# EAGLE schematic AK4493-v1.64_21 (EAGLE 9.6.2)
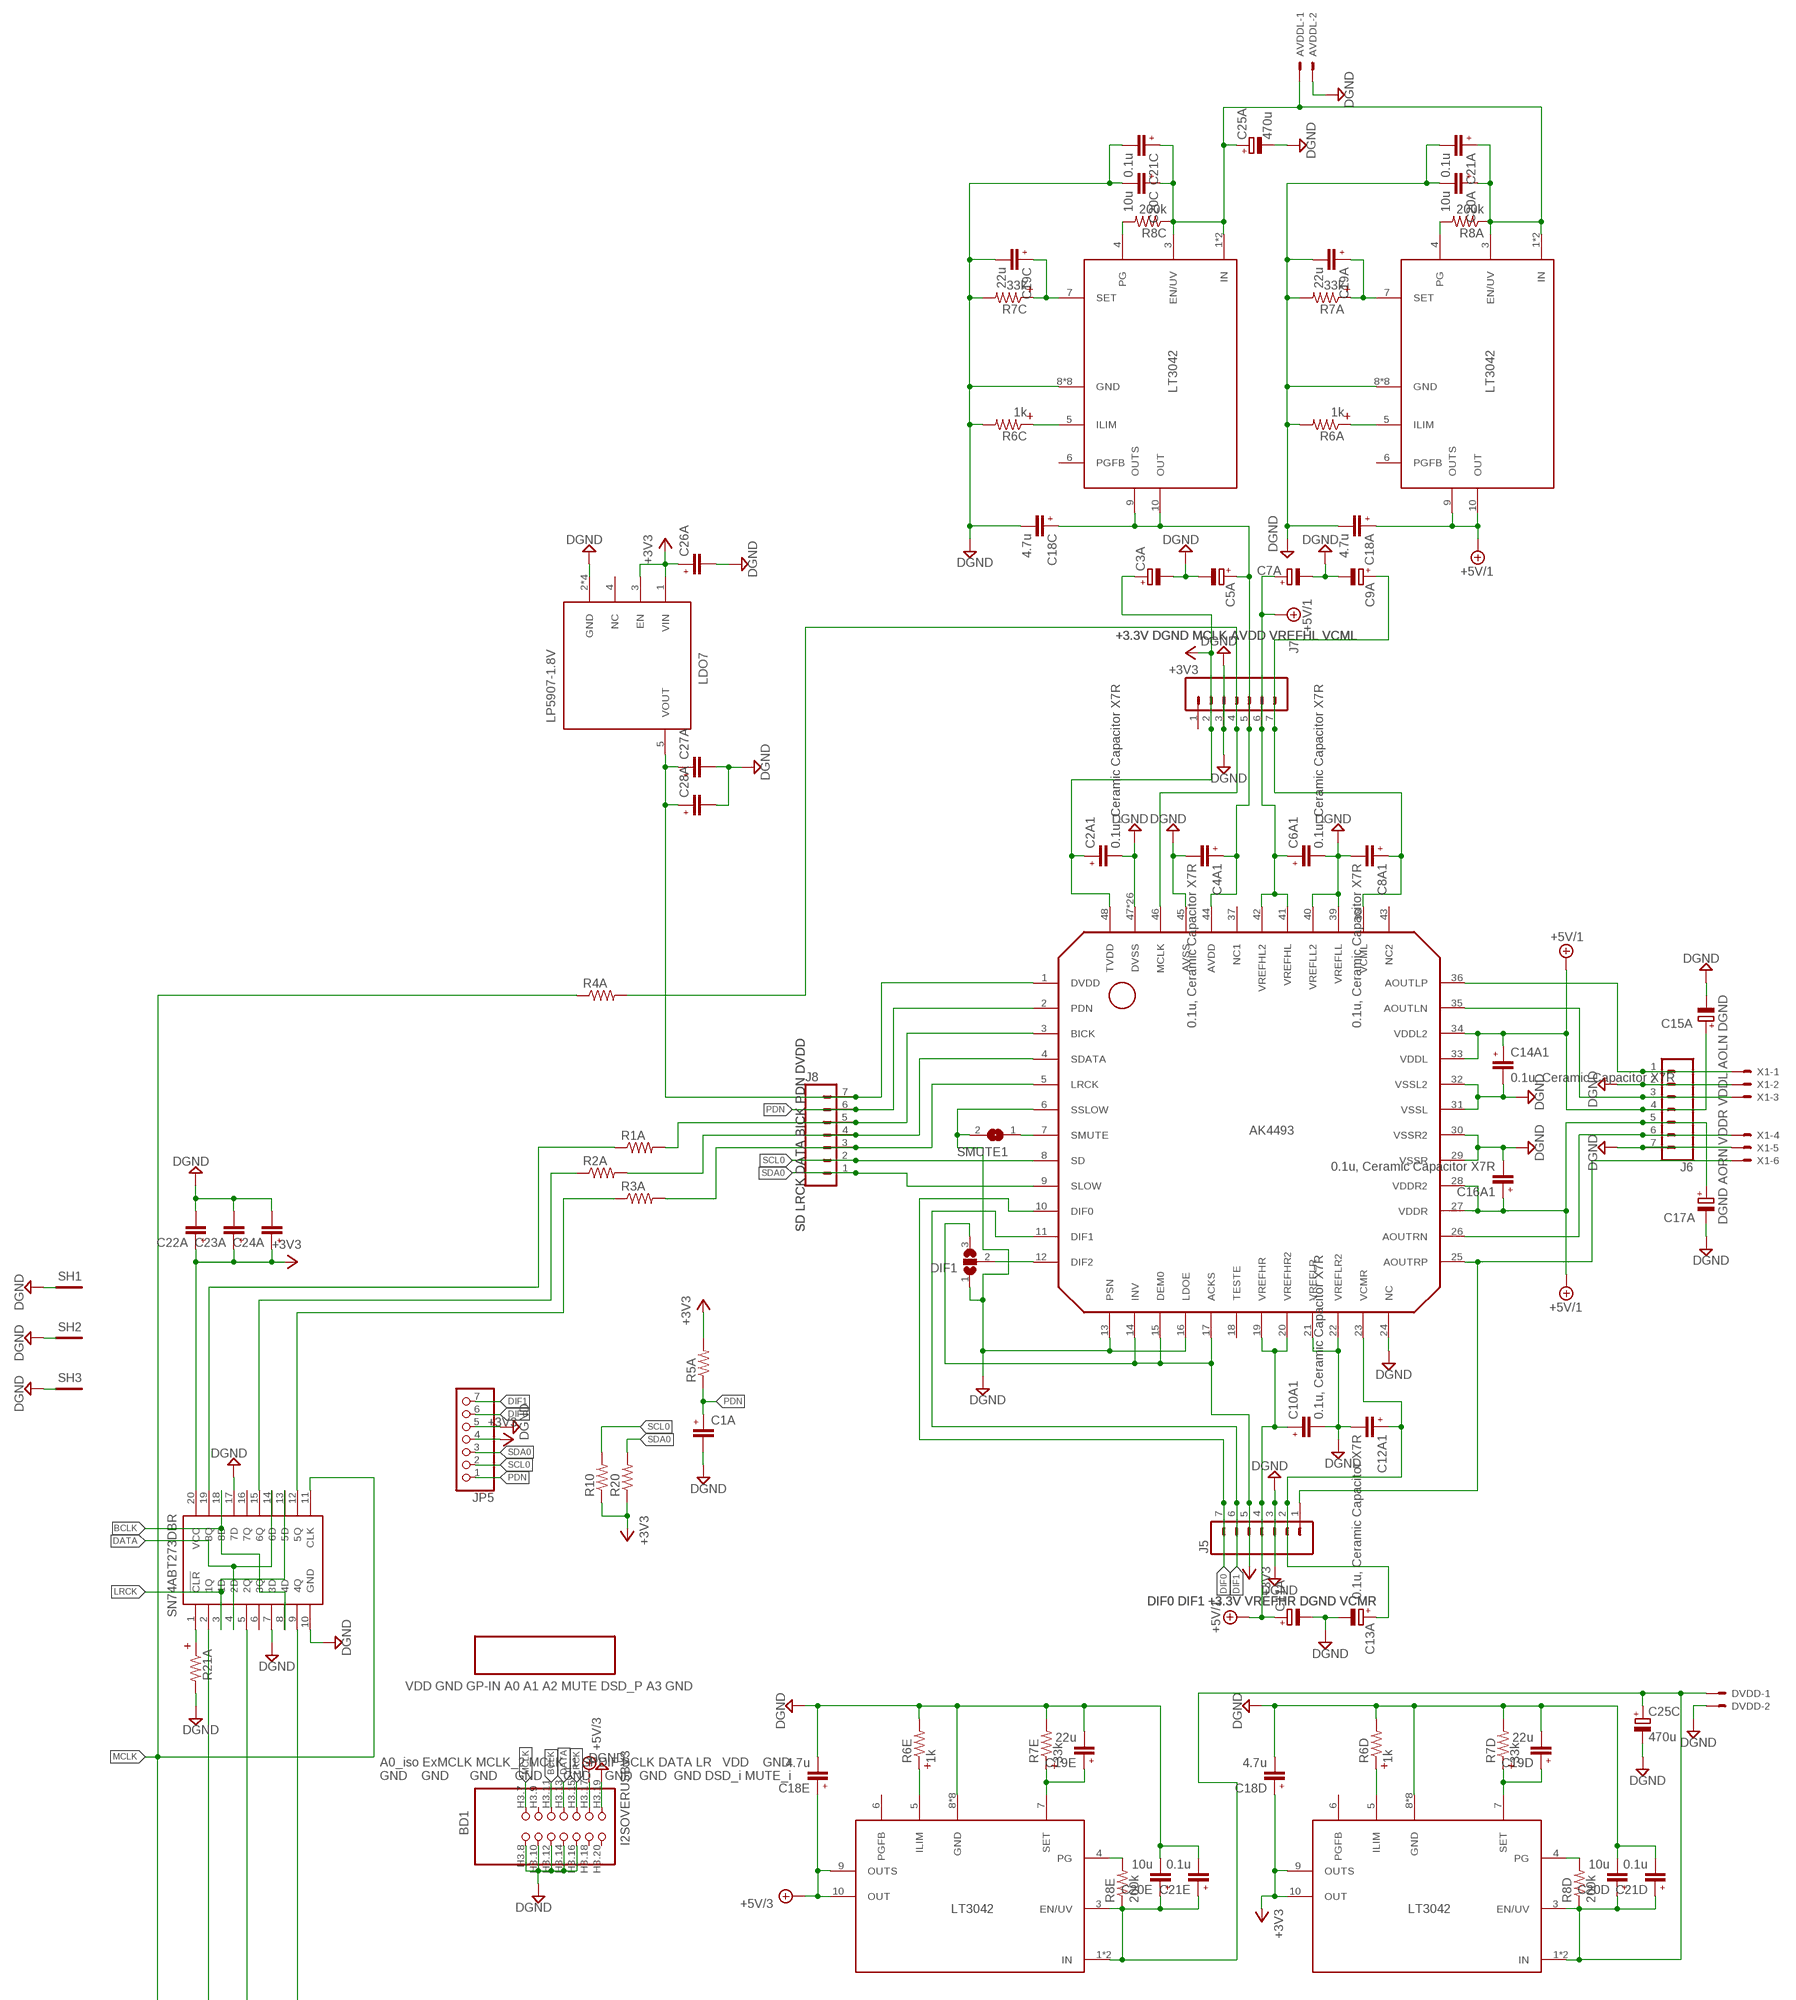
[diagram p0: schematic, sheet 1, part 1 of 2]
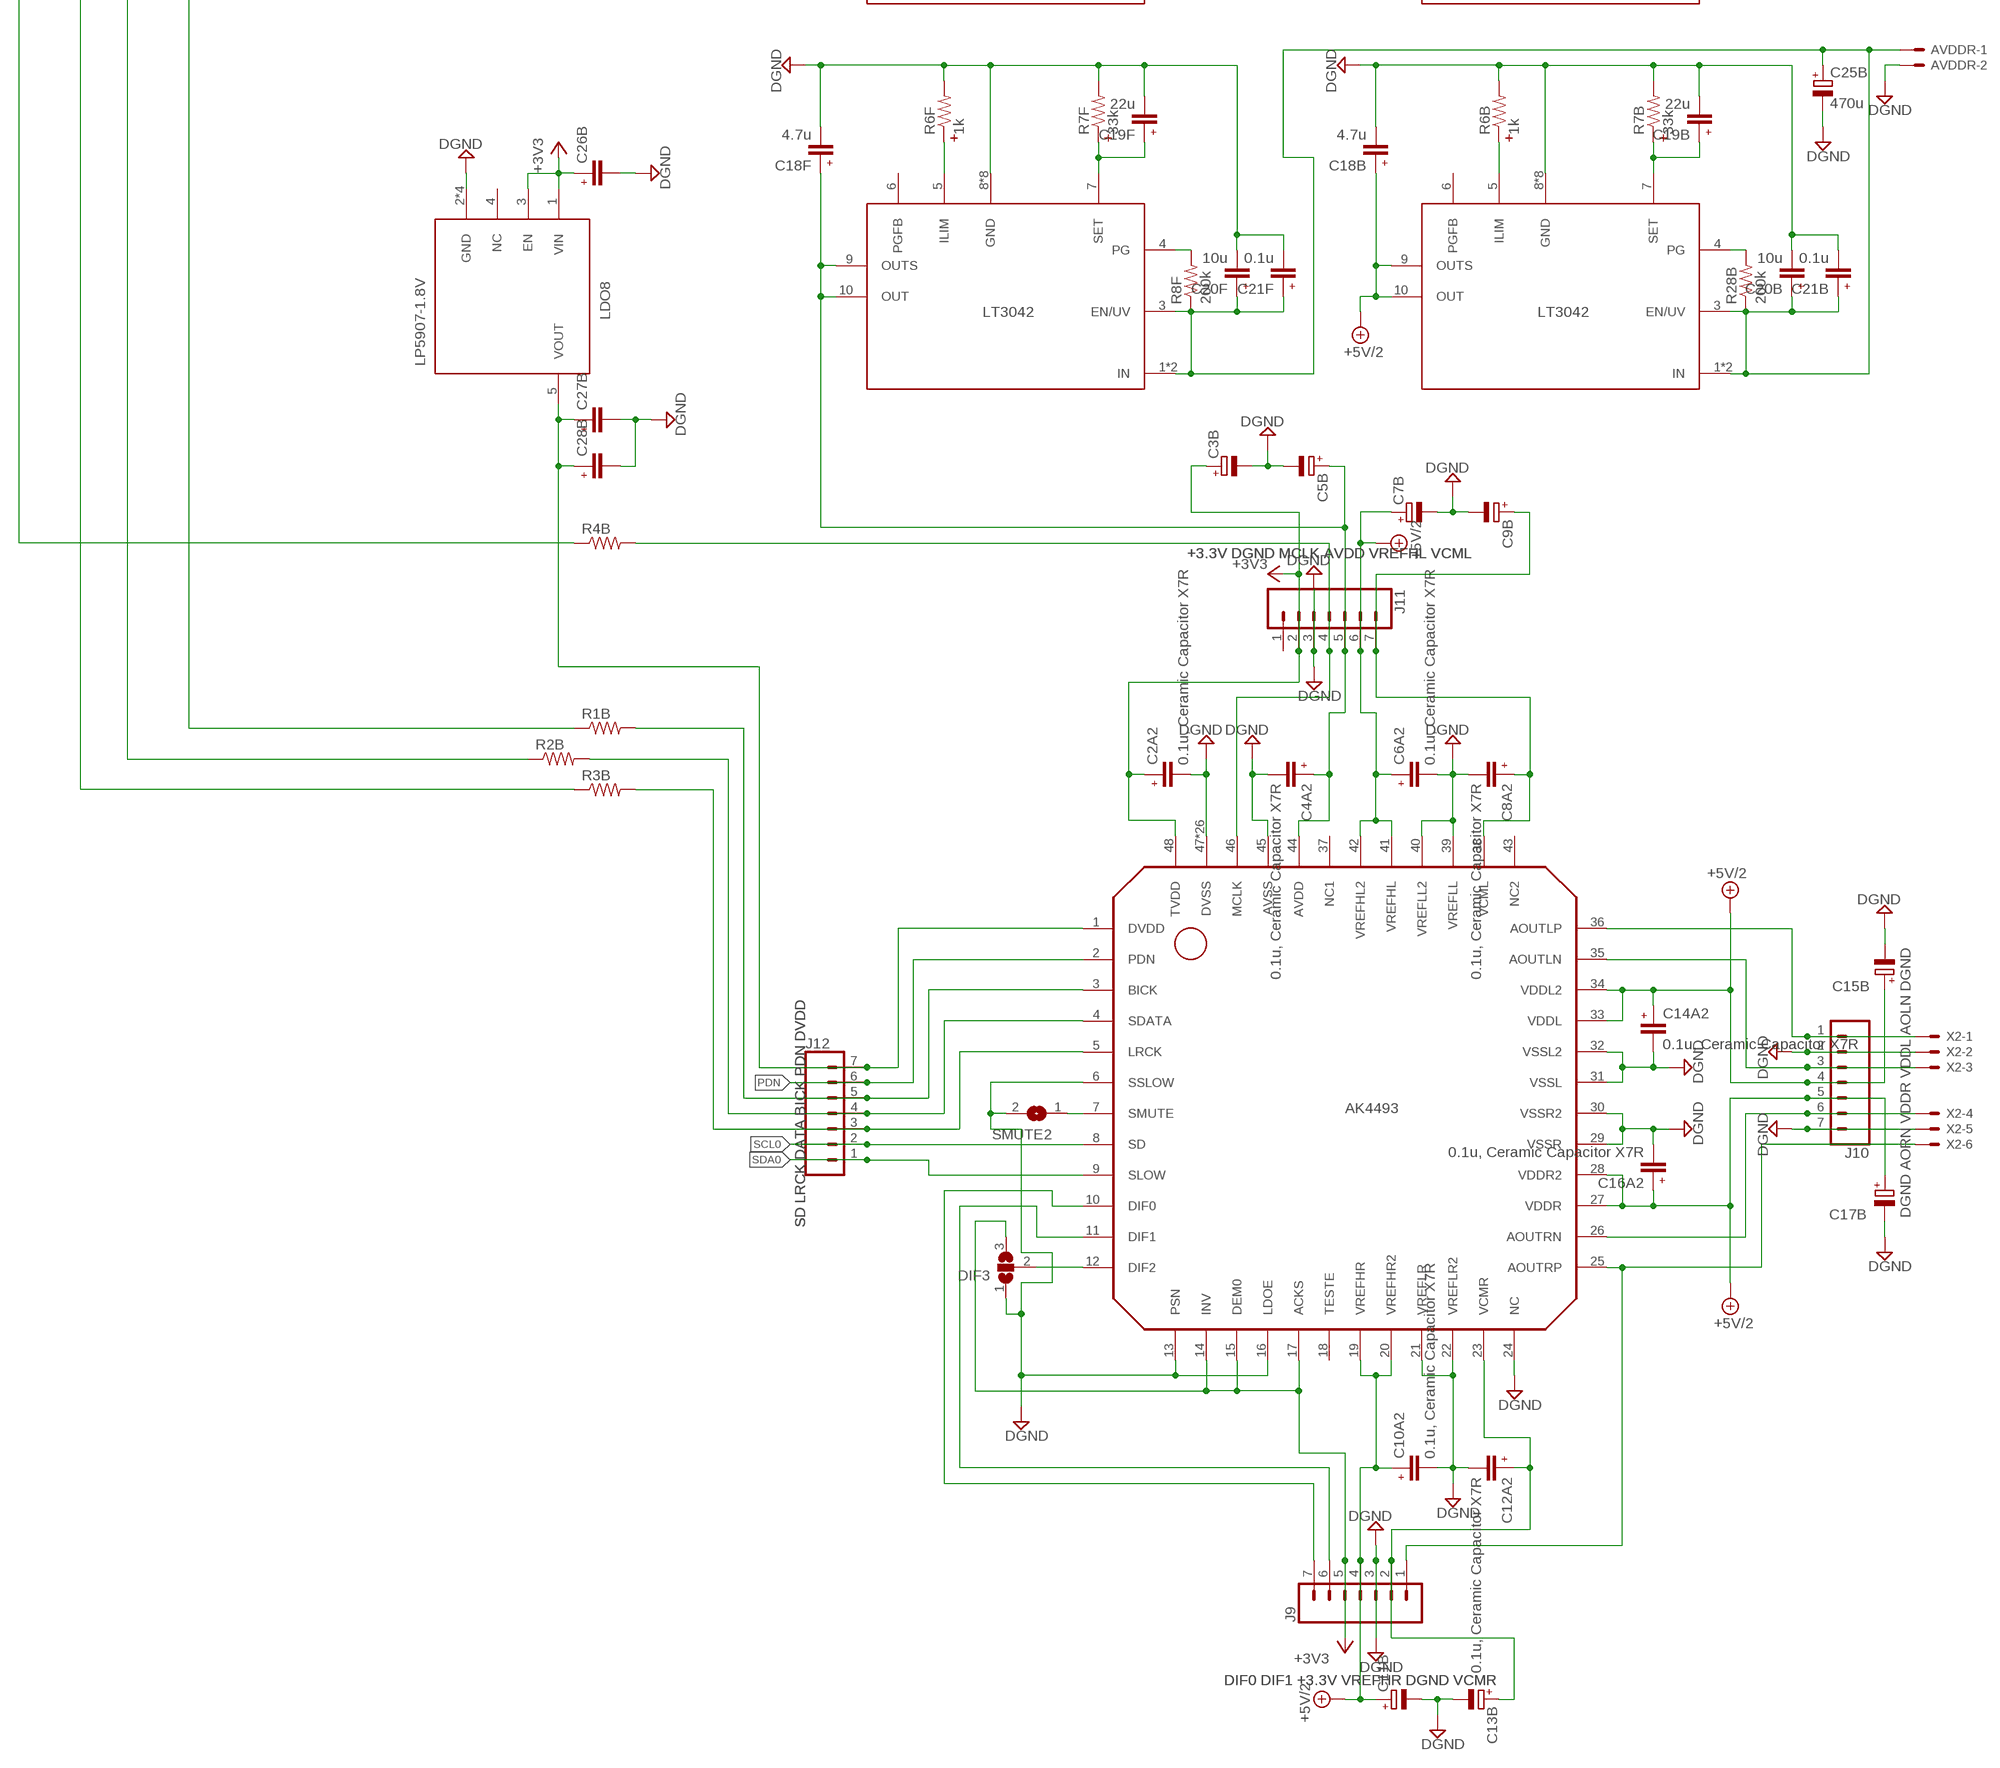
[diagram p1: schematic, sheet 1, part 2 of 2]

## Parts
AVDDL  22-23-2021  [22-23-2021]
AVDDR  22-23-2021  [22-23-2021]
BD1  I2SOVERUSBV3  [I2SOVERUSBV3]
C1A  C-EUC0805K  [C0805K]
C2A1  0.1u, Ceramic Capacitor X7R  C-EUC0603K  [C0603K]
C2A2  0.1u, Ceramic Capacitor X7R  C-EUC0603K  [C0603K]
C3A  CPOL-EUE2.5-5  [E2,5-5]
C3B  CPOL-EUE2.5-5  [E2,5-5]
C4A1  0.1u, Ceramic Capacitor X7R  C-EUC0603K  [C0603K]
C4A2  0.1u, Ceramic Capacitor X7R  C-EUC0603K  [C0603K]
C5A  CPOL-EUE2.5-5  [E2,5-5]
C5B  CPOL-EUE2.5-5  [E2,5-5]
C6A1  0.1u, Ceramic Capacitor X7R  C-EUC0603K  [C0603K]
C6A2  0.1u, Ceramic Capacitor X7R  C-EUC0603K  [C0603K]
C7A  CPOL-EUE5-8.5  [E5-8,5]
C7B  CPOL-EUE5-8.5  [E5-8,5]
C8A1  0.1u, Ceramic Capacitor X7R  C-EUC0603K  [C0603K]
C8A2  0.1u, Ceramic Capacitor X7R  C-EUC0603K  [C0603K]
C9A  CPOL-EUE2-4  [E2-4]
C9B  CPOL-EUE2-4  [E2-4]
C10A1  0.1u, Ceramic Capacitor X7R  C-EUC0603K  [C0603K]
C10A2  0.1u, Ceramic Capacitor X7R  C-EUC0603K  [C0603K]
C11A  CPOL-EUE5-8.5  [E5-8,5]
C11B  CPOL-EUE5-8.5  [E5-8,5]
C12A1  0.1u, Ceramic Capacitor X7R  C-EUC0603K  [C0603K]
C12A2  0.1u, Ceramic Capacitor X7R  C-EUC0603K  [C0603K]
C13A  CPOL-EUE2-4  [E2-4]
C13B  CPOL-EUE2-4  [E2-4]
C14A1  0.1u, Ceramic Capacitor X7R  C-EUC0603K  [C0603K]
C14A2  0.1u, Ceramic Capacitor X7R  C-EUC0603K  [C0603K]
C15A  CPOL-EUE2-4  [E2-4]
C15B  CPOL-EUE2-4  [E2-4]
C16A1  0.1u, Ceramic Capacitor X7R  C-EUC0603K  [C0603K]
C16A2  0.1u, Ceramic Capacitor X7R  C-EUC0603K  [C0603K]
C17A  CPOL-EUE2-4  [E2-4]
C17B  CPOL-EUE2-4  [E2-4]
C18A  4.7u  C-EUC0805K  [C0805K]
C18B  4.7u  C-EUC0805K  [C0805K]
C18C  4.7u  C-EUC0805K  [C0805K]
C18D  4.7u  C-EUC0805K  [C0805K]
C18E  4.7u  C-EUC0805K  [C0805K]
C18F  4.7u  C-EUC0805K  [C0805K]
C19A  22u  C-EUC1206K  [C1206K]
C19B  22u  C-EUC1206K  [C1206K]
C19C  22u  C-EUC1206K  [C1206K]
C19D  22u  C-EUC1206K  [C1206K]
C19E  22u  C-EUC1206K  [C1206K]
C19F  22u  C-EUC1206K  [C1206K]
C20A  10u  C-EUC0805K  [C0805K]
C20B  10u  C-EUC0805K  [C0805K]
C20C  10u  C-EUC0805K  [C0805K]
C20D  10u  C-EUC0805K  [C0805K]
C20E  10u  C-EUC0805K  [C0805K]
C20F  10u  C-EUC0805K  [C0805K]
C21A  0.1u  C-EUC0805K  [C0805K]
C21B  0.1u  C-EUC0805K  [C0805K]
C21C  0.1u  C-EUC0805K  [C0805K]
C21D  0.1u  C-EUC0805K  [C0805K]
C21E  0.1u  C-EUC0805K  [C0805K]
C21F  0.1u  C-EUC0805K  [C0805K]
C22A  C-EUC0603K  [C0603K]
C23A  C-EUC0603K  [C0603K]
C24A  C-EUC0603K  [C0603K]
C25A  470u  CPOL-EUE2.5-7  [E2,5-7]
C25B  470u  CPOL-EUE2.5-7  [E2,5-7]
C25C  470u  CPOL-EUE2.5-7  [E2,5-7]
C26A  C-EUC0805K  [C0805K]
C26B  C-EUC0805K  [C0805K]
C27A  C-EUC0805K  [C0805K]
C27B  C-EUC0805K  [C0805K]
C28A  C-EUC0603K  [C0603K]
C28B  C-EUC0603K  [C0603K]
DIF1  SJ2W  [SJ_2]
DIF3  SJ2W  [SJ_2]
DVDD  22-23-2021  [22-23-2021]
IC2  AK4493  [LQFP48]
IC3  AK4493  [LQFP48]
IC4A  SN74ABT273DBR  [SOP65P780X200-20N]
J5  CONN_07  [1X07]
J6  CONN_07  [1X07]
J7  CONN_07  [1X07]
J8  CONN_07  [1X07]
J9  CONN_07  [1X07]
J10  CONN_07  [1X07]
J11  CONN_07  [1X07]
J12  CONN_07  [1X07]
JP5  PINHD-1X7  [1X07]
LDO1  LT3042  [SOP50P490X110-11N]
LDO2  LT3042  [SOP50P490X110-11N]
LDO3  LT3042  [SOP50P490X110-11N]
LDO4  LT3042  [SOP50P490X110-11N]
LDO5  LT3042  [SOP50P490X110-11N]
LDO6  LT3042  [SOP50P490X110-11N]
LDO7  LP5907-1.8V  [SOT95P280X145-5N]
LDO8  LP5907-1.8V  [SOT95P280X145-5N]
R1A  R-US_R0603  [R0603]
R1B  R-US_R0603  [R0603]
R2A  R-US_R0603  [R0603]
R2B  R-US_R0603  [R0603]
R3A  R-US_R0603  [R0603]
R3B  R-US_R0603  [R0603]
R4A  R-US_R0603  [R0603]
R4B  R-US_R0603  [R0603]
R5A  R-US_R0805  [R0805]
R6A  1k  R-US_R0805  [R0805]
R6B  1k  R-US_R0805  [R0805]
R6C  1k  R-US_R0805  [R0805]
R6D  1k  R-US_R0805  [R0805]
R6E  1k  R-US_R0805  [R0805]
R6F  1k  R-US_R0805  [R0805]
R7A  33k  R-US_R0805  [R0805]
R7B  33k  R-US_R0805  [R0805]
R7C  33k  R-US_R0805  [R0805]
R7D  33k  R-US_R0805  [R0805]
R7E  33k  R-US_R0805  [R0805]
R7F  33k  R-US_R0805  [R0805]
R8A  200k  R-US_R0805  [R0805]
R8C  200k  R-US_R0805  [R0805]
R8D  200k  R-US_R0805  [R0805]
R8E  200k  R-US_R0805  [R0805]
R8F  200k  R-US_R0805  [R0805]
R10  R-US_R0805  [R0805]
R20  R-US_R0805  [R0805]
R21A  R-US_R0805  [R0805]
R28B  200k  R-US_R0805  [R0805]
SH1  SHORTA5  [SHORT_ALL-50]
SH2  SHORTA5  [SHORT_ALL-50]
SH3  SHORTA5  [SHORT_ALL-50]
SMUTE1  SJ  [SJ]
SMUTE2  SJ  [SJ]
X1  22-23-2061  [22-23-2061]
X2  22-23-2061  [22-23-2061]

## Nets
+3V3: C2A1.1 C2A2.1 C3A.+ C3B.+ C18D.1 C22A.1 C23A.1 C24A.1 C26A.1 C26B.1 DIF1.3 DIF3.3 IC2.14(INV) IC2.15(DEM0) IC2.17(ACKS) IC2.48(TVDD) IC3.14(INV) IC3.15(DEM0) IC3.17(ACKS) IC3.48(TVDD) IC4A.20(VCC) J5.5 J7.2 J9.5 J11.2 JP5.4 LDO4.9(OUTS) LDO4.10(OUT) LDO7.1(VIN) LDO7.3(EN) LDO8.1(VIN) LDO8.3(EN) R5A.2 R10.1 R20.1
+5V/1: C6A1.1 C7A.+ C10A1.1 C11A.+ C14A1.1 C15A.+ C16A1.1 C17A.+ C18A.1 IC2.19(VREFHR) IC2.20(VREFHR2) IC2.27(VDDR) IC2.28(VDDR2) IC2.33(VDDL) IC2.34(VDDL2) IC2.41(VREFHL) IC2.42(VREFHL2) J5.4 J6.4 J6.5 J7.6 LDO1.9(OUTS) LDO1.10(OUT)
+5V/2: C6A2.1 C7B.+ C10A2.1 C11B.+ C14A2.1 C15B.+ C16A2.1 C17B.+ C18B.1 IC3.19(VREFHR) IC3.20(VREFHR2) IC3.27(VDDR) IC3.28(VDDR2) IC3.33(VDDL) IC3.34(VDDL2) IC3.41(VREFHL) IC3.42(VREFHL2) J9.4 J10.4 J10.5 J11.6 LDO2.9(OUTS) LDO2.10(OUT)
+5V/3: BD1.H3.17 C18E.1 LDO5.9(OUTS) LDO5.10(OUT)
BCLK: BD1.H3.11 IC4A.8(4D) IC4A.18(8D)
DATA: BD1.H3.13 IC4A.4(2D) IC4A.14(6D)
DGND: AVDDL.2 AVDDR.2 BD1.H3.8 BD1.H3.10 BD1.H3.12 BD1.H3.14 BD1.H3.16 BD1.H3.19 C1A.2 C1A.DGND C2A1.2 C2A1.DGND C2A2.2 C2A2.DGND C3A.- C3B.- C4A1.2 C4A1.DGND C4A2.2 C4A2.DGND C5A.- C5B.- C6A1.2 C6A1.DGND C6A2.2 C6A2.DGND C7A.- C7B.- C8A1.2 C8A1.DGND C8A2.2 C8A2.DGND C9A.- C9B.- C10A1.2 C10A1.DGND C10A2.2 C10A2.DGND C11A.- C11B.- C12A1.2 C12A1.DGND C12A2.2 C12A2.DGND C13A.- C13B.- C14A1.2 C14A1.DGND C14A2.2 C14A2.DGND C15A.- C15B.- C16A1.2 C16A1.DGND C16A2.2 C16A2.DGND C17A.- C17B.- C18A.2 C18A.DGND C18B.2 C18B.DGND C18C.2 C18C.DGND C18D.2 C18D.DGND C18E.2 C18E.DGND C18F.2 C18F.DGND C19A.2 C19A.DGND C19B.2 C19B.DGND C19C.2 C19C.DGND C19D.2 C19D.DGND C19E.2 C19E.DGND C19F.2 C19F.DGND C20A.2 C20A.DGND C20B.2 C20B.DGND C20C.2 C20C.DGND C20D.2 C20D.DGND C20E.2 C20E.DGND C20F.2 C20F.DGND C21A.2 C21A.DGND C21B.2 C21B.DGND C21C.2 C21C.DGND C21D.2 C21D.DGND C21E.2 C21E.DGND C21F.2 C21F.DGND C22A.2 C22A.DGND C23A.2 C23A.DGND C24A.2 C24A.DGND C25A.- C25B.- C25C.- C26A.2 C26A.DGND C26B.2 C26B.DGND C27A.2 C27A.DGND C27B.2 C27B.DGND C28A.2 C28A.DGND C28B.2 C28B.DGND DIF1.1 DIF3.1 DVDD.2 IC2.6(SSLOW) IC2.13(PSN) IC2.16(LDOE) IC2.21(VREFLR) IC2.22(VREFLR2) IC2.24(NC) IC2.29(VSSR) IC2.30(VSSR2) IC2.31(VSSL) IC2.32(VSSL2) IC2.39(VREFLL) IC2.40(VREFLL2) IC2.45(AVSS) IC2.47(DVSS) IC2.P$1(DVSS) IC2.P$2(DVSS) IC2.P$3(DVSS) IC2.P$4(DVSS) IC2.P$5(DVSS) IC2.P$6(DVSS) IC2.P$7(DVSS) IC2.P$8(DVSS) IC2.P$9(DVSS) IC2.P$10(DVSS) IC2.P$11(DVSS) IC2.P$12(DVSS) IC2.P$13(DVSS) IC2.P$14(DVSS) IC2.P$15(DVSS) IC2.P$16(DVSS) IC2.P$17(DVSS) IC2.P$18(DVSS) IC2.P$19(DVSS) IC2.P$20(DVSS) IC2.P$21(DVSS) IC2.P$22(DVSS) IC2.P$23(DVSS) IC2.P$24(DVSS) IC2.P$25(DVSS) IC3.6(SSLOW) IC3.13(PSN) IC3.16(LDOE) IC3.21(VREFLR) IC3.22(VREFLR2) IC3.24(NC) IC3.29(VSSR) IC3.30(VSSR2) IC3.31(VSSL) IC3.32(VSSL2) IC3.39(VREFLL) IC3.40(VREFLL2) IC3.45(AVSS) IC3.47(DVSS) IC3.P$1(DVSS) IC3.P$2(DVSS) IC3.P$3(DVSS) IC3.P$4(DVSS) IC3.P$5(DVSS) IC3.P$6(DVSS) IC3.P$7(DVSS) IC3.P$8(DVSS) IC3.P$9(DVSS) IC3.P$10(DVSS) IC3.P$11(DVSS) IC3.P$12(DVSS) IC3.P$13(DVSS) IC3.P$14(DVSS) IC3.P$15(DVSS) IC3.P$16(DVSS) IC3.P$17(DVSS) IC3.P$18(DVSS) IC3.P$19(DVSS) IC3.P$20(DVSS) IC3.P$21(DVSS) IC3.P$22(DVSS) IC3.P$23(DVSS) IC3.P$24(DVSS) IC3.P$25(DVSS) IC4A.7(3D) IC4A.10(GND) IC4A.17(7D) J5.3 J6.2 J6.7 J7.3 J9.3 J10.2 J10.7 J11.3 JP5.5 LDO1.8(GND) LDO1.11(GND) LDO1.P$1(GND) LDO1.P$2(GND) LDO1.P$3(GND) LDO1.P$4(GND) LDO1.P$5(GND) LDO1.P$6(GND) LDO2.8(GND) LDO2.11(GND) LDO2.P$1(GND) LDO2.P$2(GND) LDO2.P$3(GND) LDO2.P$4(GND) LDO2.P$5(GND) LDO2.P$6(GND) LDO3.8(GND) LDO3.11(GND) LDO3.P$1(GND) LDO3.P$2(GND) LDO3.P$3(GND) LDO3.P$4(GND) LDO3.P$5(GND) LDO3.P$6(GND) LDO4.8(GND) LDO4.11(GND) LDO4.P$1(GND) LDO4.P$2(GND) LDO4.P$3(GND) LDO4.P$4(GND) LDO4.P$5(GND) LDO4.P$6(GND) LDO5.8(GND) LDO5.11(GND) LDO5.P$1(GND) LDO5.P$2(GND) LDO5.P$3(GND) LDO5.P$4(GND) LDO5.P$5(GND) LDO5.P$6(GND) LDO6.8(GND) LDO6.11(GND) LDO6.P$1(GND) LDO6.P$2(GND) LDO6.P$3(GND) LDO6.P$4(GND) LDO6.P$5(GND) LDO6.P$6(GND) LDO7.2(GND) LDO7.DGND2(GND) LDO7.DGND3(GND) LDO7.DGND(GND) LDO8.2(GND) LDO8.DGND2(GND) LDO8.DGND3(GND) LDO8.DGND(GND) R6A.2 R6A.DGND R6B.2 R6B.DGND R6C.2 R6C.DGND R6D.2 R6D.DGND R6E.2 R6E.DGND R6F.2 R6F.DGND R7A.2 R7A.DGND R7B.2 R7B.DGND R7C.2 R7C.DGND R7D.2 R7D.DGND R7E.2 R7E.DGND R7F.2 R7F.DGND R21A.2 R21A.DGND SH1.1 SH2.1 SH3.1 SMUTE1.2 SMUTE2.2 X1.2 X1.5 X2.2 X2.5
DIF0: IC2.10(DIF0) J5.7 JP5.6
DIF1: IC2.11(DIF1) J5.6 JP5.7
LRCK: BD1.H3.15 IC4A.3(1D) IC4A.13(5D)
MCLK: BD1.H3.7 IC4A.11(CLK) R4A.1 R4B.1
N$1: IC4A.1(!CLR) R21A.1
N$2: C8A2.1 C9B.+ IC3.38(VCML) J11.7
N$4: C4A1.1 C5A.+ C18C.1 IC2.44(AVDD) J7.5 LDO3.9(OUTS) LDO3.10(OUT)
N$5: LDO3.5(ILIM) R6C.1
N$6: LDO4.5(ILIM) R6D.1
N$7: C19D.1 LDO4.7(SET) R7D.1
N$8: LDO4.4(PG) R8D.2
N$9: LDO5.5(ILIM) R6E.1
N$10: C19E.1 LDO5.7(SET) R7E.1
N$11: IC3.46(MCLK) J11.4 R4B.2
N$13: LDO5.4(PG) R8E.2
N$14: C20D.1 C20E.1 C21D.1 C21E.1 C25C.+ DVDD.1 LDO4.1(IN) LDO4.2(IN) LDO4.3(EN/UV) LDO5.1(IN) LDO5.2(IN) LDO5.3(EN/UV) R8D.1 R8E.1
N$15: LDO1.5(ILIM) R6A.1
N$19: IC2.5(LRCK) J8.3 R3A.2
N$20: IC2.4(SDATA) J8.4 R2A.2
N$21: IC2.3(BICK) J8.5 R1A.2
N$22: C19A.1 LDO1.7(SET) R7A.1
N$23: IC4A.19(8Q) R1A.1
N$24: IC4A.15(6Q) R2A.1
N$25: IC4A.12(5Q) R3A.1
N$26 [R_Audio]: IC2.26(AOUTRN) J6.6 X1.4
N$27: IC3.3(BICK) J12.5 R1B.2
N$28: IC3.4(SDATA) J12.4 R2B.2
N$29: IC3.5(LRCK) J12.3 R3B.2
N$30: IC4A.9(4Q) R1B.1
N$31: IC4A.5(2Q) R2B.1
N$32: IC4A.2(1Q) R3B.1
N$33: LDO1.4(PG) R8A.2
N$35: LDO6.5(ILIM) R6F.1
N$36: C19F.1 LDO6.7(SET) R7F.1
N$37: C27A.1 C28A.1 IC2.1(DVDD) J8.7 LDO7.5(VOUT)
N$39: LDO6.4(PG) R8F.2
N$40: AVDDL.1 C20A.1 C20C.1 C21A.1 C21C.1 C25A.+ LDO1.1(IN) LDO1.2(IN) LDO1.3(EN/UV) LDO3.1(IN) LDO3.2(IN) LDO3.3(EN/UV) R8A.1 R8C.1
N$42: C4A2.1 C5B.+ C18F.1 IC3.44(AVDD) J11.5 LDO6.9(OUTS) LDO6.10(OUT)
N$43: C19C.1 LDO3.7(SET) R7C.1
N$44: LDO3.4(PG) R8C.2
N$48: LDO2.5(ILIM) R6B.1
N$49: C19B.1 LDO2.7(SET) R7B.1
N$50: LDO2.4(PG) R28B.2
N$51: AVDDR.1 C20B.1 C20F.1 C21B.1 C21F.1 C25B.+ LDO2.1(IN) LDO2.2(IN) LDO2.3(EN/UV) LDO6.1(IN) LDO6.2(IN) LDO6.3(EN/UV) R8F.1 R28B.1
N$66: C27B.1 C28B.1 IC3.1(DVDD) J12.7 LDO8.5(VOUT)
N$69: C12A1.1 C13A.+ IC2.23(VCMR) J5.2
N$79: IC3.36(AOUTLP) J10.1 X2.1
N$80: IC3.25(AOUTRP) J9.1 X2.6
N$81: IC3.10(DIF0) J9.7
N$82 [L_Audio]: IC2.36(AOUTLP) J6.1 X1.1
N$83 [L_Audio]: IC2.35(AOUTLN) J6.3 X1.3
N$87: IC3.35(AOUTLN) J10.3 X2.3
N$88: IC3.26(AOUTRN) J10.6 X2.4
N$90: IC2.25(AOUTRP) J5.1 X1.6
N$96: IC2.46(MCLK) J7.4 R4A.2
N$101: C12A2.1 C13B.+ IC3.23(VCMR) J9.2
N$102: C8A1.1 C9A.+ IC2.38(VCML) J7.7
N$105: DIF1.2 IC2.12(DIF2)
N$106: IC2.7(SMUTE) SMUTE1.1
N$107: DIF3.2 IC3.12(DIF2)
N$114: IC3.7(SMUTE) SMUTE2.1
N$116: IC3.11(DIF1) J9.6
PDN: C1A.1 IC2.2(PDN) IC3.2(PDN) J8.6 J12.6 JP5.1 R5A.1
SCL0: IC2.8(SD) IC3.8(SD) J8.2 J12.2 JP5.2 R10.2
SDA0: IC2.9(SLOW) IC3.9(SLOW) J8.1 J12.1 JP5.3 R20.2
Unconnected: BD1.H3.9 BD1.H3.18 BD1.H3.20 IC2.18(TESTE) IC2.37(NC1) IC2.43(NC2) IC3.18(TESTE) IC3.37(NC1) IC3.43(NC2) IC4A.6(3Q) IC4A.16(7Q) J7.1 J11.1 LDO1.6(PGFB) LDO2.6(PGFB) LDO3.6(PGFB) LDO4.6(PGFB) LDO5.6(PGFB) LDO6.6(PGFB) LDO7.4(NC) LDO8.4(NC) SH1.2 SH2.2 SH3.2

## Notes on the sheet
- +3.3V DGND MCLK AVDD VREFHL VCML | +3.3V DGND MCLK AVDD VREFHL VCML
- DGND AORN VDDR VDDL AOLN DGND
- SD LRCK DATA BICK PDN DVDD | SD LRCK DATA BICK PDN DVDD
- DIF0 DIF1 +3.3V VREFHR DGND VCMR | DIF0 DIF1 +3.3V VREFHR DGND VCMR
- +3.3V DGND MCLK AVDD VREFHL VCML | +3.3V DGND MCLK AVDD VREFHL VCML
- DGND AORN VDDR VDDL AOLN DGND
- SD LRCK DATA BICK PDN DVDD | SD LRCK DATA BICK PDN DVDD
- DIF0 DIF1 +3.3V VREFHR DGND VCMR | DIF0 DIF1 +3.3V VREFHR DGND VCMR

## Library data of the parts
AVDDL AVDDR DVDD = con-molex:22-23-2021: .100" (2.54mm) Center Header - 2 Pin; MF: MOLEX; MPN: 22-23-2021; OC_FARNELL: 1462926; OC_NEWARK: 25C3832
BD1 = Hifi Nutube DAC (Next 6) 28:I2SOVERUSBV3: Asynchronous audio transfer at sampling rates up to 768 kHz and 32 bit; BOM: Yes; DESCRIPTION: Asynchronous audio transfer at sampling rates up to 768 kHz and 32 bit
C1A C2A1 C2A2 C4A1 C4A2 C6A1 C6A2 C8A1 C8A2 C10A1 C10A2 C12A1 C12A2 C14A1 C14A2 C16A1 C16A2 C18A C18B C18C C18D C18E C18F C19A C19B C19C C19D C19E C19F C20A C20B C20C C20D C20E C20F C21A C21B C21C C21D C21E C21F C22A C23A C24A C26A C26B C27A C27B C28A C28B = rcl_user:C-EU: CAPACITOR, European symbol; SPICEPREFIX: C
C3A C3B C5A C5B C7A C7B C9A C9B C11A C11B C13A C13B C15A C15B C17A C17B C25A C25B C25C = rcl:CPOL-EU: POLARIZED CAPACITOR, European symbol; SPICEPREFIX: C
DIF1 DIF3 = jumper:SJ2W: SMD solder JUMPER
IC2 IC3 = Dual Mono Amp Lib:AK4493: Quality Oriented 32-Bit 2ch DAC 32-Bit, 768 kHz with VELVET SOUND
IC4A = SN74ABT273DBR:SN74ABT273DBR: Octal Edge-Triggered D-Type Flip-Flops With Clear Source: Datasheet <http://www.ti.com/lit/gpn/sn74abt273>; DESCRIPTION: Octal Edge-Triggered D-Type Flip-Flops With Clear; HEIGHT: 2mm; MANUFACTURER_NAME: Texas Instruments; MANUFACTURER_PART_NUMBER: SN74ABT273DBR; MOUSER_PART_NUMBER: 595-SN74ABT273DBR; MOUSER_PRICE-STOCK: https://www.mouser.co.uk/ProductDetail/Texas-Instruments/SN74ABT273DBR?qs=X1HXWTtiZ0RWq%2Fv0JNOEpw%3D%3D
J5-J12 = SparkFun-Connectors:CONN_07: Multi connection point. Often used as Generic Header-pin footprint for 0.1 inch spaced/style header connections On any of the 0.1 inch spaced packages, you can populate with these: Break Away Headers - Straight <https://www.sparkfun.com/products/116> (PRT-00116) Break Away Male Headers - Right Angle <https://www.sparkfun.com/products/553> (PRT-00553) Female Headers <https://www.sparkfun.com/products/115> (PRT-00115) Break Away Headers - Machine Pin <https://www.sparkfun.com/products/117> (PRT-00117) Break Away Female Headers - Swiss Machine Pin <https://www.sparkfun.com/products/743> (PRT-00743) For SCREWTERMINALS and SPRING TERMINALS visit here: Screw Terimnals on SparkFun.com <https://www.sparkfun.com/search/results?term=Screw+Terminals> (5mm/3.5mm/2.54mm spacing) This device is also useful as a general connection point to wire up your design to another part of your project. Our various solder wires solder well into these plated through hole pads. Hook-Up Wire - Assortment (Stranded, 22 AWG) <https://www.sparkfun.com/products/11375> (PRT-11375) Hook-Up Wire - Assortment (Solid Core, 22 AWG) <https://www.sparkfun.com/products/11367> (PRT-11367) View the entire wire category on our website here <https://www.sparkfun.com/categories/141> Special notes: Molex polarized connector foot print use with SKU : PRT-08231 with associated crimp pins and housings. 1MM SMD Version SKU: PRT-10208 NOTES ON THE VARIANTS LOCK and LOCK_LONGPADS... This footprint was designed to help hold the alignment of a through-hole component (i.e. 6-pin header) while soldering it into place. You may notice that each hole has been shifted either up or down by 0.005 of an inch from it's more standard position (which is a perfectly straight line). This slight alteration caused the pins (the squares in the middle) to touch the edges of the holes. Because they are alternating, it causes a "brace" to hold the component in place. 0.005 has proven to be the perfect amount of "off-center" position when using our standard breakaway headers. Although looks a little odd when you look at the bare footprint, once you have a header in there, the alteration is very hard to notice. Also,if you push a header all the way into place, it is covered up entirely on the bottom side.
JP5 = pinhead:PINHD-1X7: PIN HEADER
LDO1-LDO6 = Dual Mono Amp Lib:LT3042: LINEAR TECHNOLOGY - LT3042EMSE#PBF - LDO, ADJ, 0.2A, 0V-15V, MSOP-10 Source: Datasheet <http://www.linear.com/docs/46159>; DESCRIPTION: LINEAR TECHNOLOGY - LT3042EMSE#PBF - LDO, ADJ, 0.2A, 0V-15V, MSOP-10; HEIGHT: 1.1mm; MANUFACTURER_NAME: Linear Technology; MANUFACTURER_PART_NUMBER: LT3042EMSE#PBF; MOUSER_PART_NUMBER: 584-LT3042EMSE#PBF; MOUSER_PRICE-STOCK: https://www.mouser.co.uk/ProductDetail/Analog-Devices-Linear-Technology/LT3042EMSEPBF?qs=oahfZPh6IAJ3XP16d20ITw%3D%3D
LDO7 LDO8 = Dual Mono Amp Lib:LP5907-1.8V: 250-mA ultra-low-noise low-IQ low-dropout (LDO) linear regulator Source: Datasheet <http://www.ti.com/lit/gpn/lp5907>; ARROW_PART_NUMBER: LP5907MFX-1.8/NOPB; ARROW_PRICE-STOCK: https://www.arrow.com/en/products/lp5907mfx-1.8nopb/texas-instruments?region=nac; DESCRIPTION: 250-mA ultra-low-noise low-IQ low-dropout (LDO) linear regulator; HEIGHT: 1.45mm; MANUFACTURER_NAME: Texas Instruments; MANUFACTURER_PART_NUMBER: LP5907MFX-1.8/NOPB; MOUSER_PART_NUMBER: 595-LP5907MFX-1.8NPB; MOUSER_PRICE-STOCK: https://www.mouser.co.uk/ProductDetail/Texas-Instruments/LP5907MFX-1.8-NOPB?qs=biyDIajrTn5jh5ArkSZeqw%3D%3D
R1A R1B R2A R2B R3A R3B R4A R4B R5A R8A R8C R8D R8E R8F R10 R20 R28B = rcl:R-US_: RESISTOR, American symbol; SPICEPREFIX: R
R6A R6B R6C R6D R6E R6F R7A R7B R7C R7D R7E R7F R21A = Dual Mono Amp Lib:R-US_: RESISTOR, American symbol; SPICEPREFIX: R
SH1-SH3 = Hifi Nutube DAC (Next 6) 28:SHORT: Short between two nets; BOM: No; DESCRIPTION: Short between two nets
SMUTE1 SMUTE2 = jumper:SJ: SMD solder JUMPER
X1 X2 = con-molex:22-23-2061: .100" (2.54mm) Center Header - 6 Pin; MF: MOLEX; MPN: 22-23-2061; OC_FARNELL: 1462922; OC_NEWARK: 27C1933

## Net classes
3 Power: width 1.27 mm, drill 1.27 mm, clearance 0.254 mm